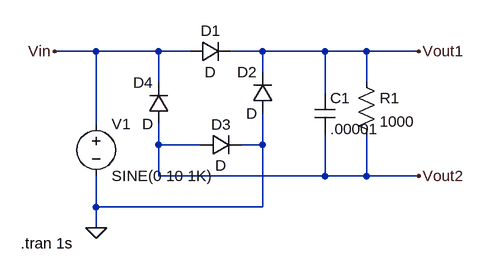
[diagram p0: schematic Draft3.asc]
Draft3.asc, the LTspice schematic file:
Version 4
SHEET 1 880 680
WIRE 0 112 -64 112
WIRE 96 112 0 112
WIRE 144 112 96 112
WIRE 256 112 208 112
WIRE 352 112 256 112
WIRE 416 112 352 112
WIRE 496 112 416 112
WIRE 256 144 256 112
WIRE 96 160 96 112
WIRE 416 160 416 112
WIRE 352 176 352 112
WIRE 0 224 0 112
WIRE 96 256 96 224
WIRE 160 256 96 256
WIRE 256 256 256 208
WIRE 256 256 224 256
WIRE 96 304 96 256
WIRE 352 304 352 240
WIRE 352 304 96 304
WIRE 416 304 416 240
WIRE 416 304 352 304
WIRE 496 304 416 304
WIRE 0 352 0 304
WIRE 256 352 256 256
WIRE 256 352 0 352
WIRE 0 384 0 352
FLAG 0 384 0
FLAG -64 112 Vin
FLAG 496 112 Vout1
FLAG 496 304 Vout2
SYMBOL diode 144 128 R270
WINDOW 0 32 32 VTop 2
WINDOW 3 0 32 VBottom 2
SYMATTR InstName D1
SYMBOL diode 112 224 R180
WINDOW 0 24 64 Left 2
WINDOW 3 24 0 Left 2
SYMATTR InstName D4
SYMBOL voltage 0 208 R0
WINDOW 123 0 0 Left 0
WINDOW 39 0 0 Left 0
SYMATTR InstName V1
SYMATTR Value SINE(0 10 1K)
SYMBOL diode 272 208 R180
WINDOW 0 24 64 Left 2
WINDOW 3 24 0 Left 2
SYMATTR InstName D2
SYMBOL diode 160 272 R270
WINDOW 0 32 32 VTop 2
WINDOW 3 0 32 VBottom 2
SYMATTR InstName D3
SYMBOL res 400 144 R0
SYMATTR InstName R1
SYMATTR Value 1000
SYMBOL cap 336 176 R0
SYMATTR InstName C1
SYMATTR Value .00001
TEXT -116 408 Left 2 !.tran 1s

The netlist it stands for:
* Draft3.asc
D1 Vin Vout1 D
D4 Vout2 Vin D
V1 Vin 0 SINE(0 10 1K)
D2 0 Vout1 D
D3 Vout2 0 D
R1 Vout1 Vout2 1000
C1 Vout1 Vout2 .00001
.model D D
.lib standard.dio
.tran 1s
.backanno
.end